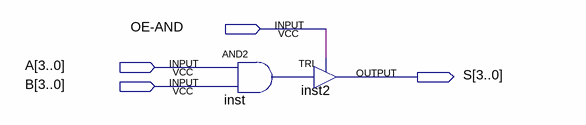
[diagram p0: schematic sheet]
// Quartus schematic AND_4.bdf as structural Verilog: 2 symbols, 4 pins
module AND_4 (
  input  \OE-AND ,
  input  [3:0] A,
  input  [3:0] B,
  output [3:0] S
);

  wire inst_out;

  assign inst_out = A & B;  // AND2 inst, 4 bits wide
  TRI inst2[3:0] (.IN(inst_out), .OE(\OE-AND ), .OUT(S));
endmodule
